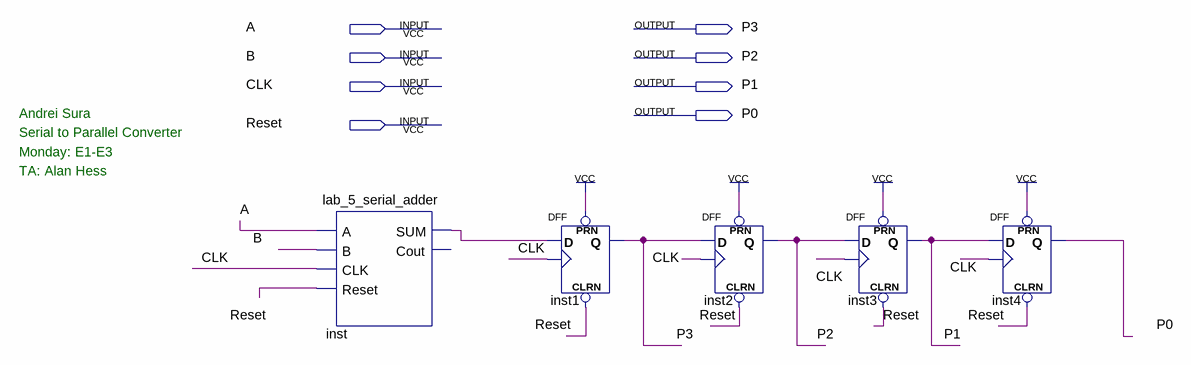
[diagram p0: schematic sheet]
// Quartus schematic lab5_serial_para_conv_part3.bdf as structural Verilog: 5 symbols, 8 pins
module lab5_serial_para_conv_part3 (
  input  A,
  input  B,
  input  CLK,
  input  Reset,
  output P3,
  output P2,
  output P1,
  output P0
);

  wire inst_sum;

  lab_5_serial_adder inst (.A(A), .B(B), .CLK(CLK), .Reset(Reset), .SUM(inst_sum));  // open: Cout
  DFF inst1 (.CLRN(Reset), .CLK(CLK), .D(inst_sum), .PRN(1'b1), .Q(P3));
  DFF inst2 (.CLRN(Reset), .CLK(CLK), .D(P3), .PRN(1'b1), .Q(P2));
  DFF inst3 (.CLRN(Reset), .CLK(CLK), .D(P2), .PRN(1'b1), .Q(P1));
  DFF inst4 (.CLRN(Reset), .CLK(CLK), .D(P1), .PRN(1'b1), .Q(P0));

  // Notes on the sheet:
  //   Andrei Sura
  //   Serial to Parallel Converter
  //   Monday: E1-E3
  //   TA: Alan Hess
endmodule
